# EAGLE design superteensy (EAGLE 7.1.0)
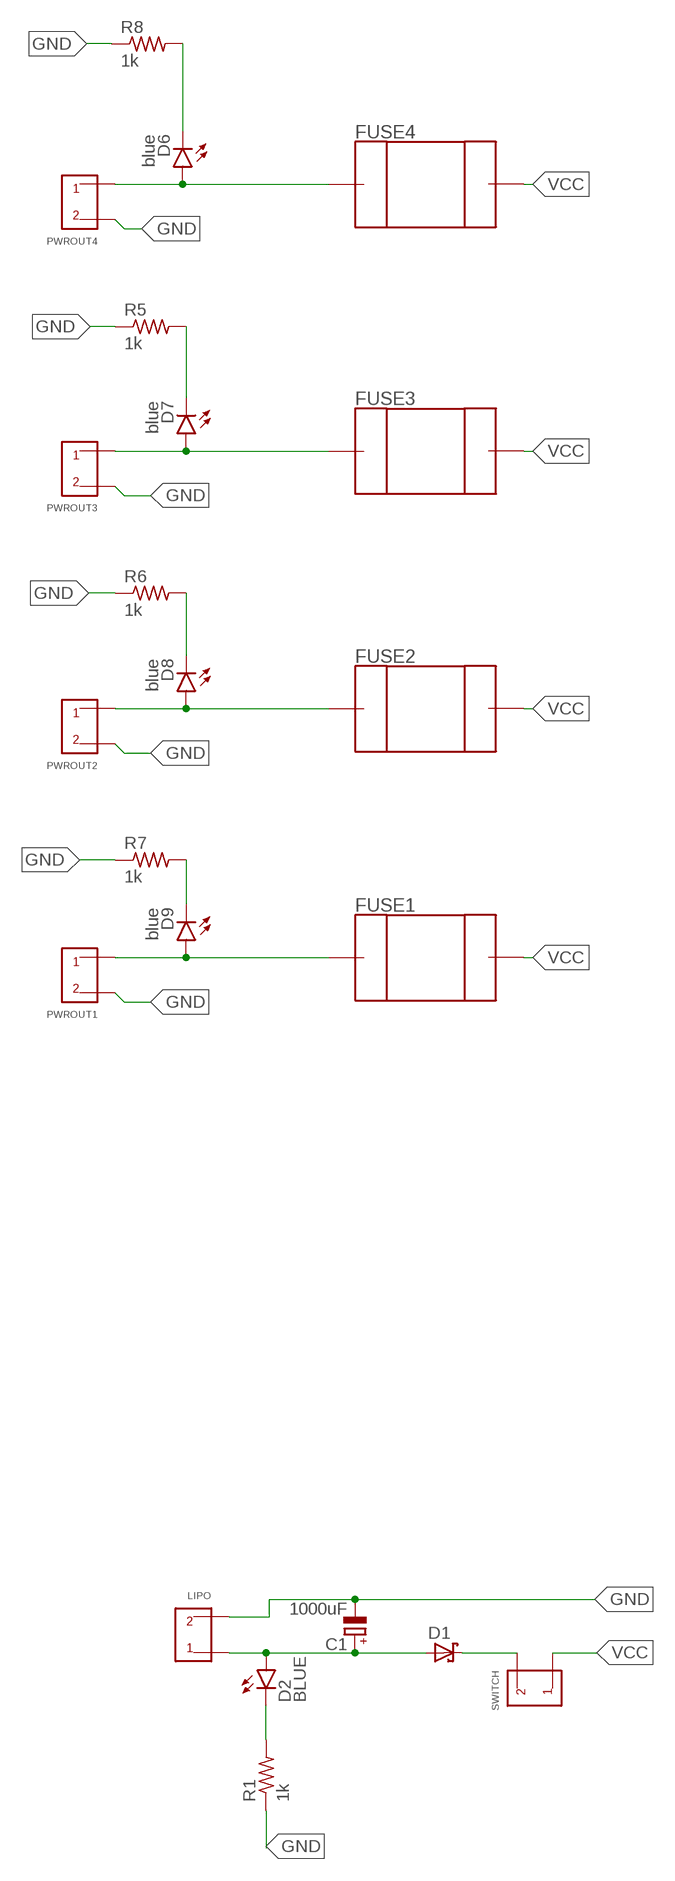
[diagram p0: schematic, sheet 1, part 1 of 2]
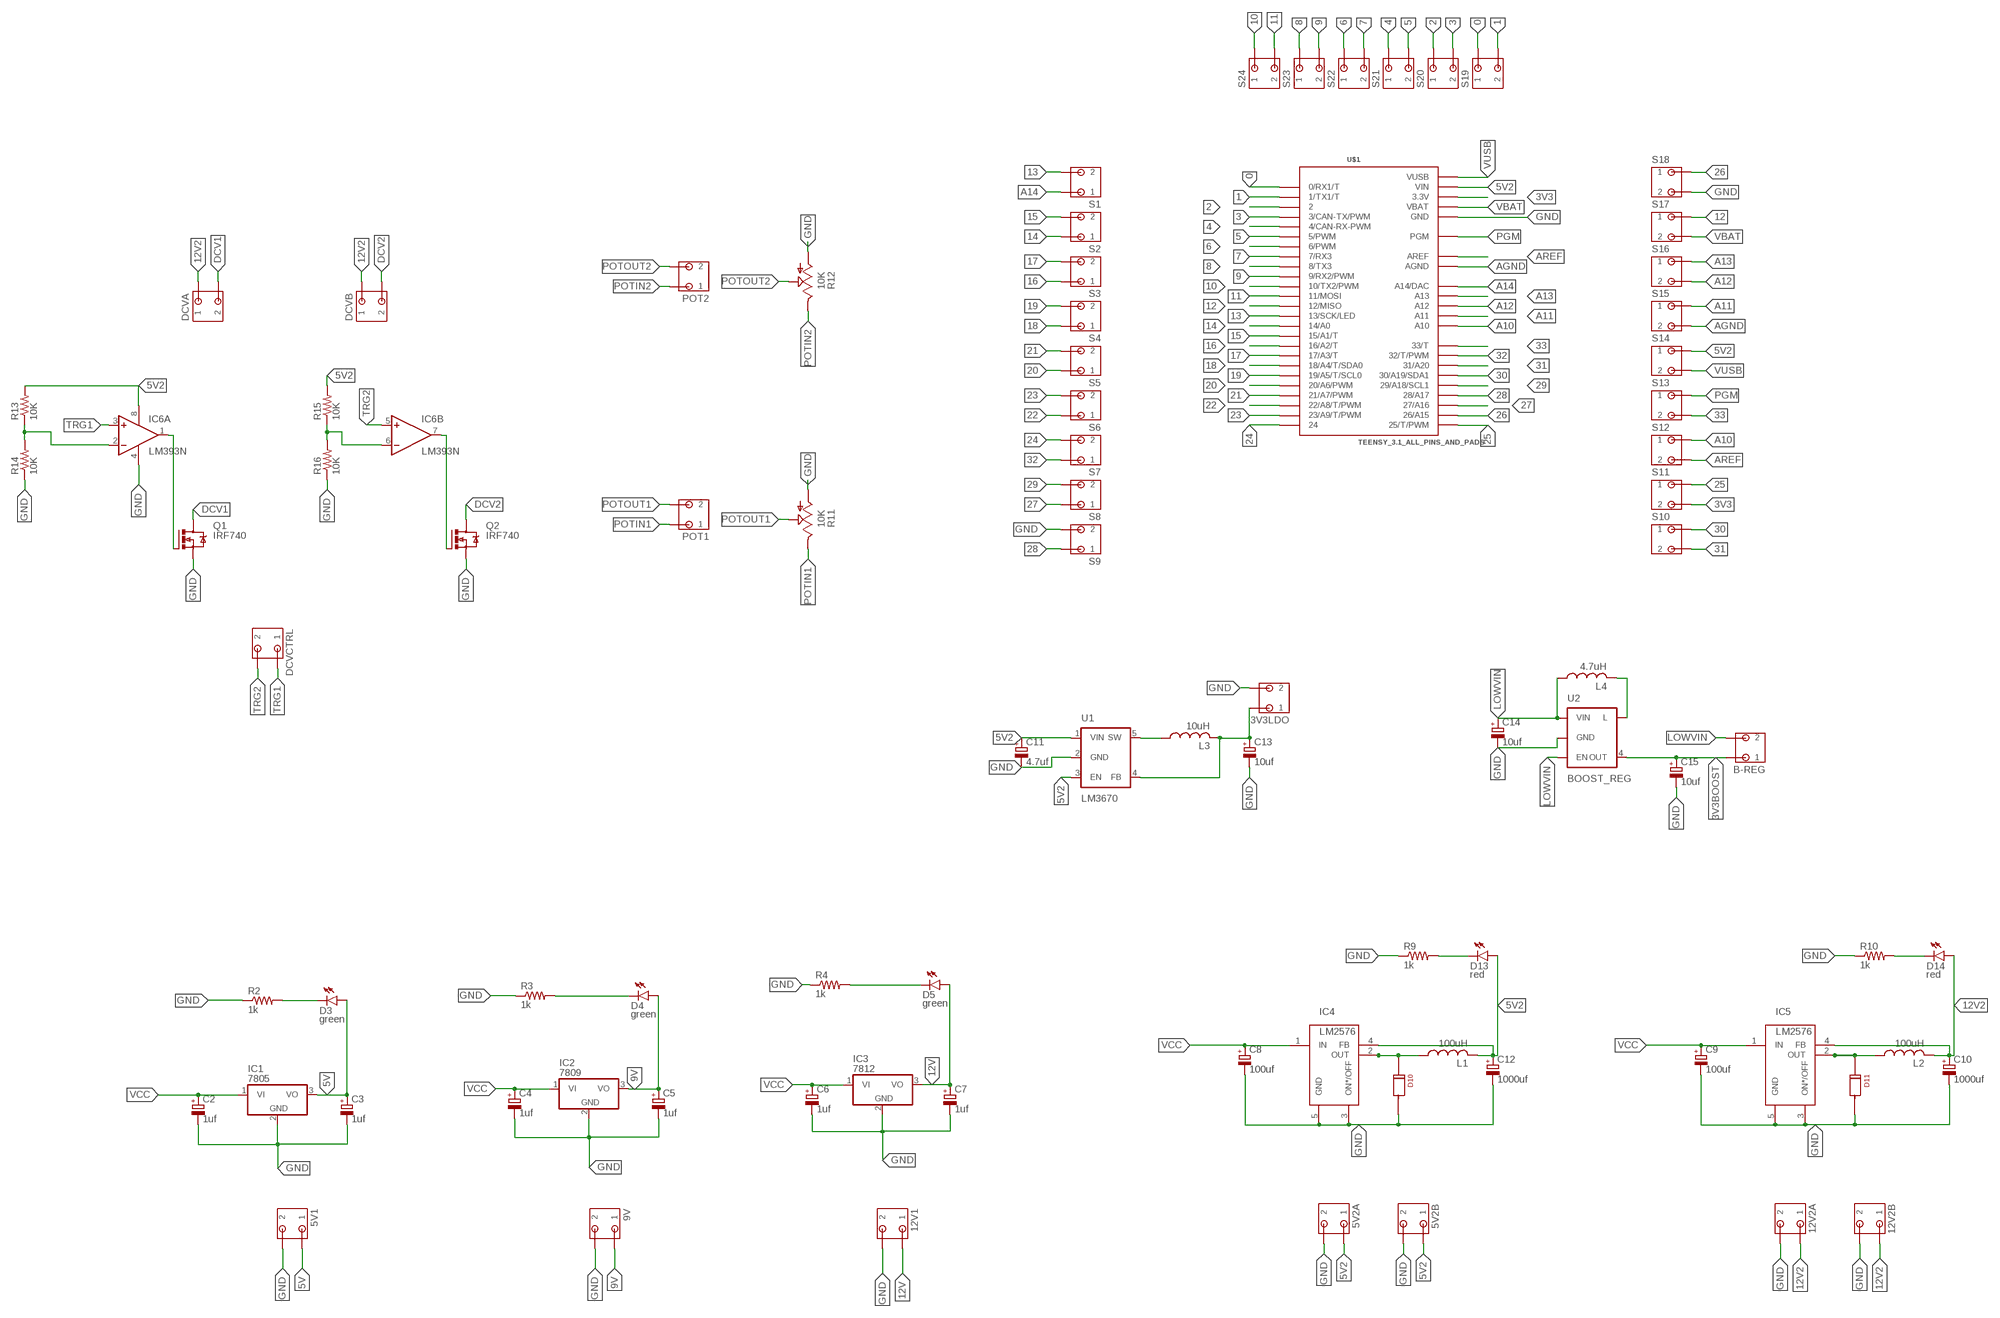
[diagram p1: schematic, sheet 1, part 2 of 2]

## Parts
3V3LDO  SPTBA2-B2  [SPTB]
5V1  SPTBA2-B2  [SPTB]
5V2A  SPTBA2-B2  [SPTB]
5V2B  SPTBA2-B2  [SPTB]
9V  SPTBA2-B2  [SPTB]
12V1  SPTBA2-B2  [SPTB]
12V2A  SPTBA2-B2  [SPTB]
12V2B  SPTBA2-B2  [SPTB]
B-REG  SPTBA2-B2  [SPTB]
C1  1000uF  CPOL-EUE7.5-16  [E7,5-16]
C2  1uf  CPOL-EUE2-5  [E2-5]
C3  1uf  CPOL-EUE2-5  [E2-5]
C4  1uf  CPOL-EUE2-5  [E2-5]
C5  1uf  CPOL-EUE2-5  [E2-5]
C6  1uf  CPOL-EUE2-5  [E2-5]
C7  1uf  CPOL-EUE2-5  [E2-5]
C8  100uf  CPOL-EUE2,5-6E  [E2,5-6E]
C9  100uf  CPOL-EUE2,5-6E  [E2,5-6E]
C10  1000uf  CPOL-EUE7.5-16  [E7,5-16]
C11  4.7uf  CPOL-EUE2-5  [E2-5]
C12  1000uf  CPOL-EUE7.5-16  [E7,5-16]
C13  10uf  CPOL-EUE2-5  [E2-5]
C14  10uf  CPOL-EUE2-5  [E2-5]
C15  10uf  CPOL-EUE2-5  [E2-5]
D1  SCHOTTKY-DIODEP6T15  [P6T15]
D2  BLUE  LED5MM  [LED5MM]
D3  green  LED5MM  [LED5MM]
D4  green  LED5MM  [LED5MM]
D5  green  LED5MM  [LED5MM]
D6  blue  LED5MM  [LED5MM]
D7  blue  LED5MM  [LED5MM]
D8  blue  LED5MM  [LED5MM]
D9  blue  LED5MM  [LED5MM]
D10  1N5822  [1N5822]
D11  1N5822  [1N5822]
D13  red  LED5MM  [LED5MM]
D14  red  LED5MM  [LED5MM]
DCVA  SPTBA2-B2  [SPTB]
DCVB  SPTBA2-B2  [SPTB]
DCVCTRL  SPTBA2-B2  [SPTB]
FUSE1  CPT-FUSE  [CPT-FUSES]
FUSE2  CPT-FUSE  [CPT-FUSES]
FUSE3  CPT-FUSE  [CPT-FUSES]
FUSE4  CPT-FUSE  [CPT-FUSES]
IC1  7805  [78XX]
IC2  7809  [78XX]
IC3  7812  [78XX]
IC4  LM2576  [LM2576]
IC5  LM2576  [LM2576]
IC6  LM393N  [DIL08]
L1  100uH  L-US0204/7  [0204/7]
L2  100uH  L-US0204/7  [0204/7]
L3  10uH  L-US0204/7  [0204/7]
L4  4.7uH  L-US0204/7  [0204/7]
LIPO  SCREW_XT-60  [SCREW_XT-60]
POT1  SPTBA2-B2  [SPTB]
POT2  SPTBA2-B2  [SPTB]
PWROUT1  SCREW_XT-60  [SCREW_XT-60]
PWROUT2  SCREW_XT-60  [SCREW_XT-60]
PWROUT3  SCREW_XT-60  [SCREW_XT-60]
PWROUT4  SCREW_XT-60  [SCREW_XT-60]
Q1  IRF740  [TO220BV]
Q2  IRF740  [TO220BV]
R1  1k  R-US_0204/7  [0204/7]
R2  1k  R-US_0204/7  [0204/7]
R3  1k  R-US_0204/7  [0204/7]
R4  1k  R-US_0204/7  [0204/7]
R5  1k  R-US_0204/7  [0204/7]
R6  1k  R-US_0204/7  [0204/7]
R7  1k  R-US_0204/7  [0204/7]
R8  1k  R-US_0204/7  [0204/7]
R9  1k  R-US_0204/7  [0204/7]
R10  1k  R-US_0204/7  [0204/7]
R11  10K  TRIM_US-CA6V  [CA6V]
R12  10K  TRIM_US-CA6V  [CA6V]
R13  10K  R-US_0204/7  [0204/7]
R14  10K  R-US_0204/7  [0204/7]
R15  10K  R-US_0204/7  [0204/7]
R16  10K  R-US_0204/7  [0204/7]
S1  SPTBA2-B2  [SPTB]
S2  SPTBA2-B2  [SPTB]
S3  SPTBA2-B2  [SPTB]
S4  SPTBA2-B2  [SPTB]
S5  SPTBA2-B2  [SPTB]
S6  SPTBA2-B2  [SPTB]
S7  SPTBA2-B2  [SPTB]
S8  SPTBA2-B2  [SPTB]
S9  SPTBA2-B2  [SPTB]
S10  SPTBA2-B2  [SPTB]
S11  SPTBA2-B2  [SPTB]
S12  SPTBA2-B2  [SPTB]
S13  SPTBA2-B2  [SPTB]
S14  SPTBA2-B2  [SPTB]
S15  SPTBA2-B2  [SPTB]
S16  SPTBA2-B2  [SPTB]
S17  SPTBA2-B2  [SPTB]
S18  SPTBA2-B2  [SPTB]
S19  SPTBA2-B2  [SPTB]
S20  SPTBA2-B2  [SPTB]
S21  SPTBA2-B2  [SPTB]
S22  SPTBA2-B2  [SPTB]
S23  SPTBA2-B2  [SPTB]
S24  SPTBA2-B2  [SPTB]
SWITCH  SCREW_XT-60  [SCREW_XT-60]
U1  LM3670  V_REG_LDOSMD  [SOT23-5]
U2  BOOST_REG  V_REG_LDOSMD  [SOT23-5]
U$1  TEENSY_3.1_ALL_PINS_AND_PADS  [TEENSY_3.1_ALLPINS]

## Nets
0: S19.A1 S19.A2 U$1.0(0/RX1/T)
1: S19.B1 S19.B2 U$1.1(1/TX1/T)
2: S20.A1 S20.A2 U$1.2
3: S20.B1 S20.B2 U$1.3(3/CAN-TX/PWM)
3V3: S11.B1 S11.B2 U$1.3.3V U$1.3.3V1(3.3V) U$1.3.3V2(3.3V)
3V3BOOST: B-REG.A1 B-REG.A2 C15.+ U2.4(OUT)
4: S21.A1 S21.A2 U$1.4(4/CAN-RX-PWM)
5: S21.B1 S21.B2 U$1.5(5/PWM)
5V: 5V1.A1 5V1.A2 C3.+ D3.A IC1.3(VO)
5V2: 5V2A.A1 5V2A.A2 5V2B.A1 5V2B.A2 C11.+ C12.+ D13.A IC4.4(FB) IC6.8(P:V+) L1.2 R13.2 R15.2 S14.A1 S14.A2 U1.1(VIN) U1.3(EN) U$1.VIN
6: S22.A1 S22.A2 U$1.6(6/PWM)
7: S22.B1 S22.B2 U$1.7(7/RX3)
8: S23.A1 S23.A2 U$1.8(8/TX3)
9: S23.B1 S23.B2 U$1.9(9/RX2/PWM)
9V: 9V.A1 9V.A2 C5.+ D4.A IC2.3(VO)
10: S24.A1 S24.A2 U$1.10(10/TX2/PWM)
11: S24.B1 S24.B2 U$1.11(11/MOSI)
12: S17.A1 S17.A2 U$1.12(12/MISO)
12V: 12V1.A1 12V1.A2 C7.+ D5.A IC3.3(VO)
12V2: 12V2A.A1 12V2A.A2 12V2B.A1 12V2B.A2 C10.+ D14.A DCVA.A1 DCVA.A2 DCVB.A1 DCVB.A2 IC5.4(FB) L2.2
13: S1.B1 S1.B2 U$1.13(13/SCK/LED)
14: S2.A1 S2.A2 U$1.14/A0
15: S2.B1 S2.B2 U$1.15/A1(15/A1/T)
16: S3.A1 S3.A2 U$1.16/A2(16/A2/T)
17: S3.B1 S3.B2 U$1.17/A3(17/A3/T)
18: S4.A1 S4.A2 U$1.18/A4(18/A4/T/SDA0)
19: S4.B1 S4.B2 U$1.19/A5(19/A5/T/SCL0)
20: S5.A1 S5.A2 U$1.20/A6(20/A6/PWM)
21: S5.B1 S5.B2 U$1.21/A7(21/A7/PWM)
22: S6.A1 S6.A2 U$1.22/A8(22/A8/T/PWM)
23: S6.B1 S6.B2 U$1.23/A9(23/A9/T/PWM)
24: S7.B1 S7.B2 U$1.24
25: S11.A1 S11.A2 U$1.25(25/T/PWM)
26: S18.A1 S18.A2 U$1.26(26/A15)
27: S8.A1 S8.A2 U$1.27(27/A16)
28: S9.A1 S9.A2 U$1.28(28/A17)
29: S8.B1 S8.B2 U$1.29(29/A18/SCL1)
30: S10.A1 S10.A2 U$1.30(30/A19/SDA1)
31: S10.B1 S10.B2 U$1.31(31/A20)
32: S7.A1 S7.A2 U$1.32(32/T/PWM)
33: S13.B1 S13.B2 U$1.33(33/T)
A10: S12.A1 S12.A2 U$1.A10
A11: S15.A1 S15.A2 U$1.A11
A12: S16.B1 S16.B2 U$1.A12
A13: S16.A1 S16.A2 U$1.A13
A14: S1.A1 S1.A2 U$1.A14(A14/DAC)
AGND: S15.B1 S15.B2 U$1.AGND
AREF: S12.B1 S12.B2 U$1.AREF
DCV1: DCVA.B1 DCVA.B2 Q1.D
DCV2: DCVB.B1 DCVB.B2 Q2.D
GND: 3V3LDO.B1 3V3LDO.B2 5V1.B1 5V1.B2 5V2A.B1 5V2A.B2 5V2B.B1 5V2B.B2 9V.B1 9V.B2 12V1.B1 12V1.B2 12V2A.B1 12V2A.B2 12V2B.B1 12V2B.B2 C1.- C2.- C3.- C4.- C5.- C6.- C7.- C8.- C9.- C10.- C11.- C12.- C13.- C14.- C15.- D10.- D11.- IC1.2(GND) IC2.2(GND) IC3.2(GND) IC4.3(ON*/OFF) IC4.5(GND) IC5.3(ON*/OFF) IC5.5(GND) IC6.4(P:V-) LIPO.P$2 PWROUT1.P$2 PWROUT2.P$2 PWROUT3.P$2 PWROUT4.P$2 Q1.S Q2.S R1.1 R2.1 R3.1 R4.1 R5.1 R6.1 R7.1 R8.1 R9.1 R10.1 R11.A R12.A R14.1 R16.1 S9.B1 S9.B2 S18.B1 S18.B2 U1.2(GND) U2.2(GND) U$1.GND U$1.GND1(GND) U$1.GND2(GND)
LOWVIN: B-REG.B1 B-REG.B2 C14.+ L4.1 U2.1(VIN) U2.3(EN)
N$1: C1.+ D1.A D2.A LIPO.P$1
N$2: D1.C SWITCH.P$2
N$3: D3.K(C) R2.2
N$4: D2.K(C) R1.2
N$5: D4.K(C) R3.2
N$6: D5.K(C) R4.2
N$7: D6.A FUSE4.P$1 PWROUT4.P$1
N$8: D7.A FUSE3.P$1 PWROUT3.P$1
N$9: D8.A FUSE2.P$1 PWROUT2.P$1
N$10: D9.A FUSE1.P$1 PWROUT1.P$1
N$11: D9.K(C) R7.2
N$12: D8.K(C) R6.2
N$13: D7.K(C) R5.2
N$14: D6.K(C) R8.2
N$15: D13.K(C) R9.2
N$16: D10.+ IC4.2(OUT) L1.1
N$17: D11.+ IC5.2(OUT) L2.1
N$18: D14.K(C) R10.2
N$19: IC6.1(A:OUT) Q1.G
N$20: IC6.7(B:OUT) Q2.G
N$21: IC6.2(A:-IN) R13.1 R14.2
N$22: IC6.6(B:-IN) R15.1 R16.2
N$25: L3.1 U1.5(SW)
N$26: 3V3LDO.A1 3V3LDO.A2 C13.+ L3.2 U1.4(FB)
N$28: L4.2 U2.5(L)
PGM: S13.A1 S13.A2 U$1.PGM
POTIN1: POT1.A1 POT1.A2 R11.E
POTIN2: POT2.A1 POT2.A2 R12.E
POTOUT1: POT1.B1 POT1.B2 R11.S
POTOUT2: POT2.B1 POT2.B2 R12.S
TRG1: DCVCTRL.A1 DCVCTRL.A2 IC6.3(A:+IN)
TRG2: DCVCTRL.B1 DCVCTRL.B2 IC6.5(B:+IN)
VBAT: S17.B1 S17.B2 U$1.VBAT
VCC: C2.+ C4.+ C6.+ C8.+ C9.+ FUSE1.P$2 FUSE2.P$2 FUSE3.P$2 FUSE4.P$2 IC1.1(VI) IC2.1(VI) IC3.1(VI) IC4.1(IN) IC5.1(IN) SWITCH.P$1
VUSB: S14.B1 S14.B2 U$1.VUSB

## Library data of the parts
3V3LDO 5V1 5V2A 5V2B 9V 12V1 12V2A 12V2B B-REG DCVA DCVB POT1 POT2 S1-S24 = #rcn-15:SPTB
C1-C15 = rcl:CPOL-EU: POLARIZED CAPACITOR, European symbol
D1 = diode:SCHOTTKY-DIODE: Schottky Diode
D2-D9 D13 D14 = SparkFun-LED:LED: LEDs Standard schematic elements and footprints for 5mm, 3mm, 1206, and 0603 sized LEDs. 5mm - Spark Fun Electronics SKU : COM-00529 (and others)
D10 D11 = #rcn-15:1N5822
DCVCTRL = #rcn-15-new-A2-b2-appended:SPTB
FUSE1-FUSE4 = #rcn-15:CPT-FUSE
IC1-IC3 = #rcn-15:78*: Positive VOLTAGE REGULATOR Source: http://cache.national.com/ds/LM/LM78L05.pdf http://www.fairchildsemi.com/ds/LM/LM7805.pdf
IC4 IC5 = LM2576:LM2576: LM2576 - 5V switching regulator
IC6 = linear:LM393: COMPARATOR
L1-L4 = rcl:L-US: INDUCTOR, American symbol
LIPO PWROUT1-PWROUT4 SWITCH = #rcn-15:SCREW_XT-60
Q1 Q2 = transistor-power:IRF740: N-CHANNEL MOS FET
R1-R10 R13-R16 = rcl:R-US_: RESISTOR, American symbol
R11 R12 = pot:TRIM_US-: POTENTIOMETER
U1 = lm3670-ldo:V_REG_LDO: Voltage Regulator LDO Standard 150mA LDO voltage regulator in SOT-23 layout. Micrel part MIC5205. BP (by-pass) pin is used to lower output noise with 470pF cap.
U2 = synchronous-boot-regulator-TPS61097A-33:V_REG_LDO: Voltage Regulator LDO Standard 150mA LDO voltage regulator in SOT-23 layout. Micrel part MIC5205. BP (by-pass) pin is used to lower output noise with 470pF cap.
U$1 = Teensy_3_Series_Board_v1.0:TEENSY_3.1_ALL_PINS_AND_PADS: Footprint for Teensy 3.1 board using all pads and all through-holes. Pads need a 2x7 0.1" SMD header.

## Board
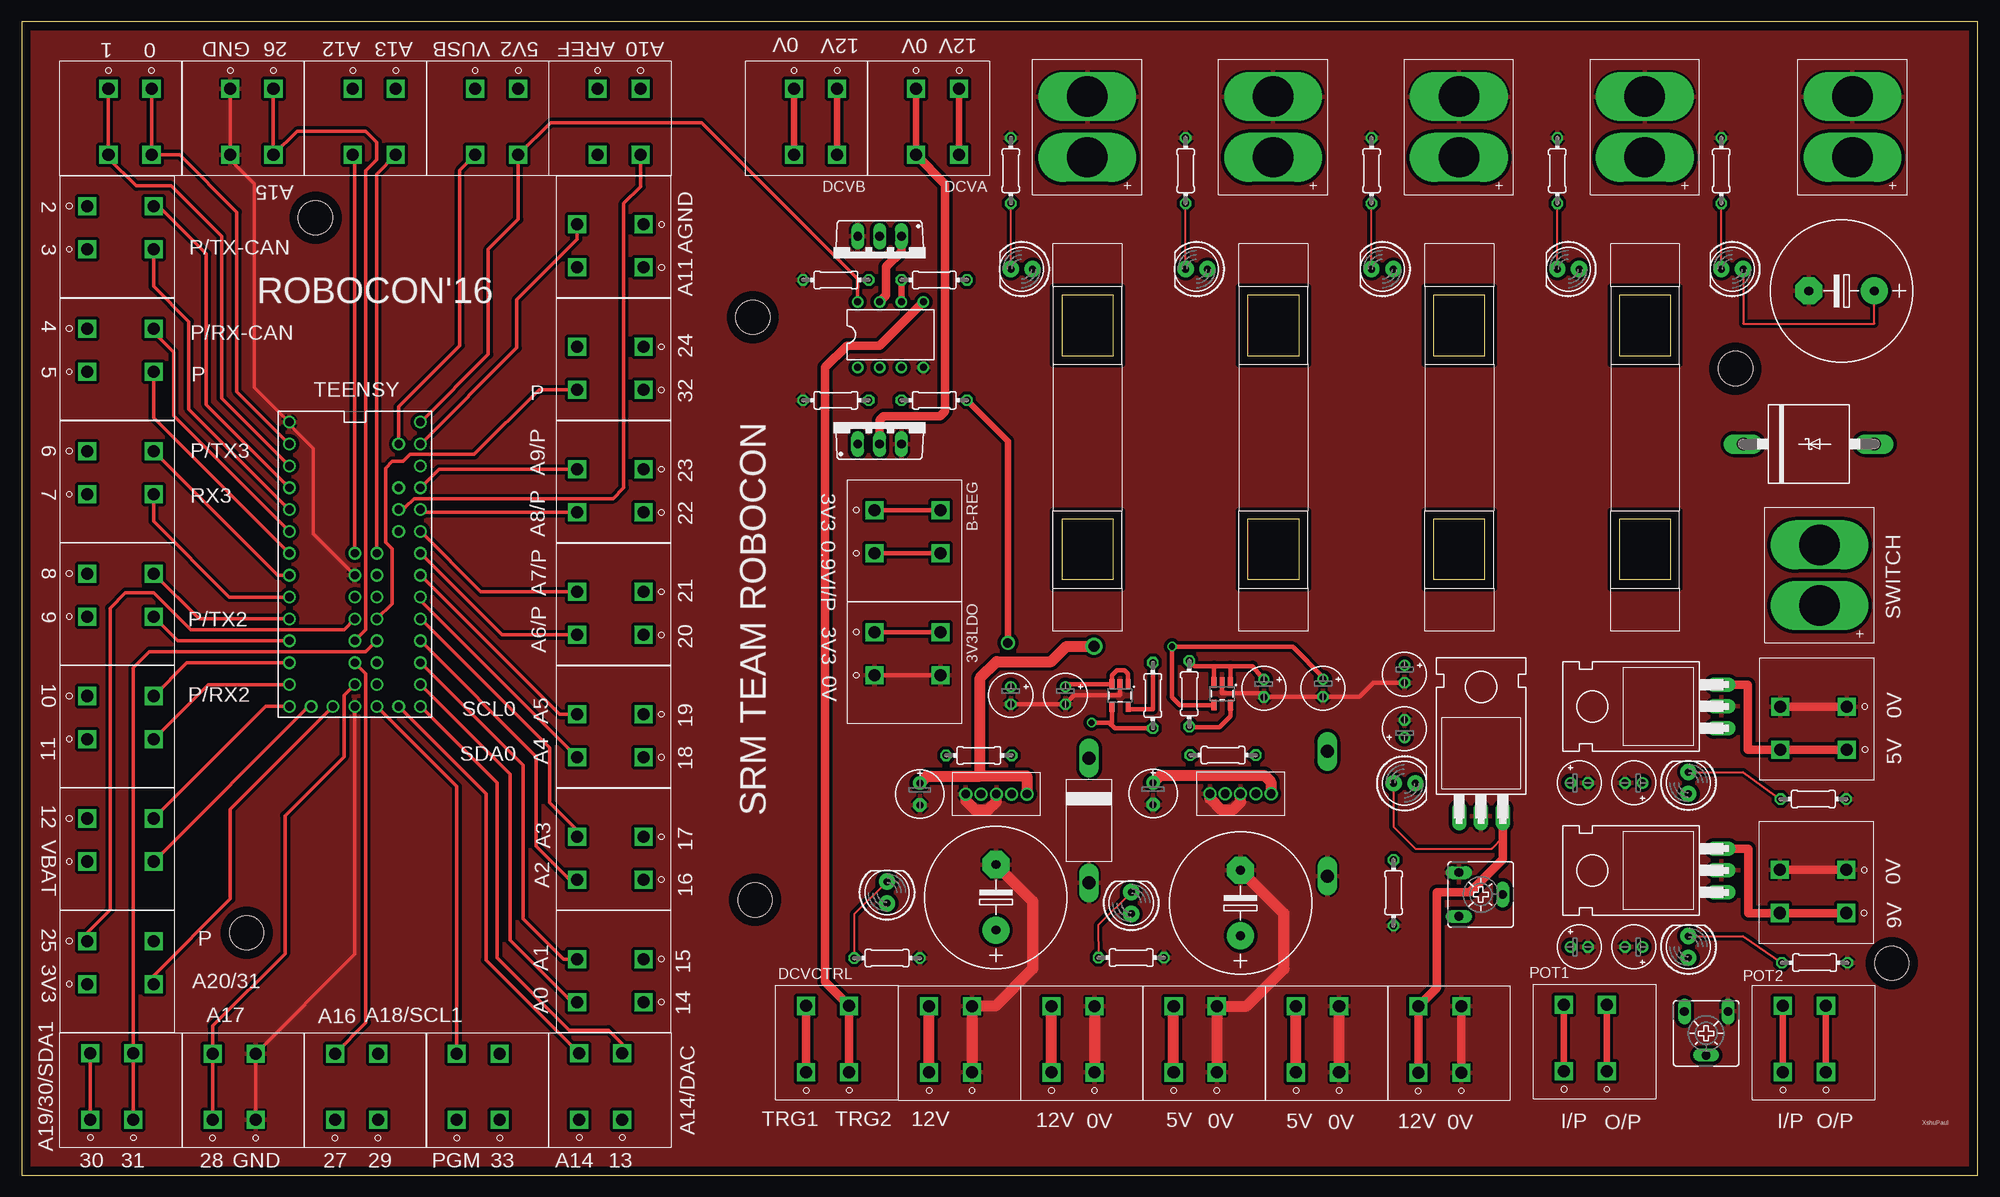
[diagram p2: board, top side]
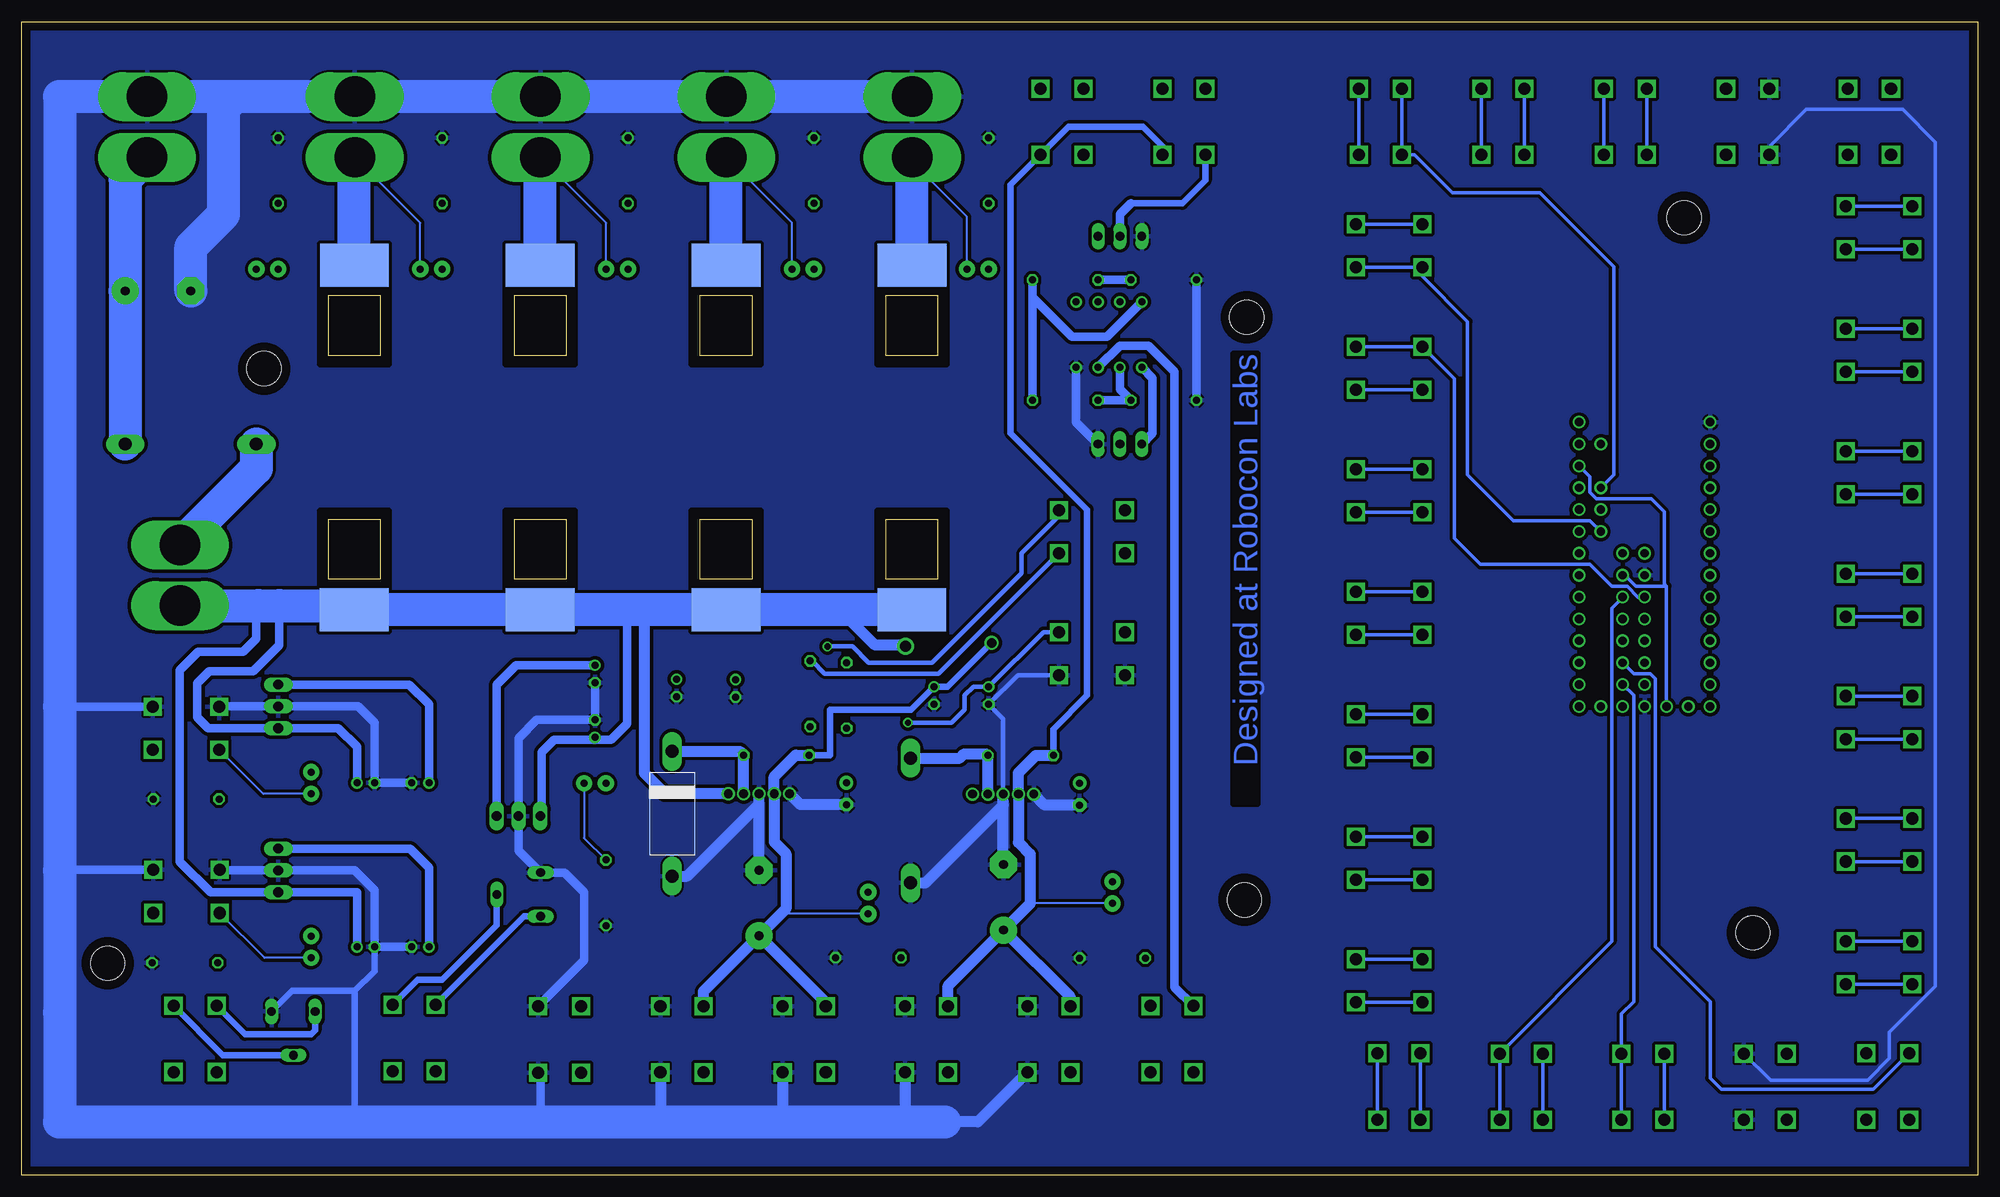
[diagram p3: board, bottom side, seen from below]

Size 227.31 x 134.04 mm. Coordinates in mm from the lower left corner, seen from the top.
Outline: 0,0 227.31,0 227.31,134.04 0,134.04 0,0
Copper layers (1*16): Top 0.035mm / dielectric 1.5mm / Bottom 0.035mm
Design rules "default *": minimum track width 10mil, minimum drill 24mil, track to track 10mil, track to pad 10mil, pad to pad 10mil, via to via 10mil, smd to smd 10mil, copper to edge 40mil, drill to drill 8mil, minimum pad ring 10mil, minimum via ring 8mil, stop-mask expansion 4mil, vias tented up to drill 0mil, thermal gap 10mil
Holes 4 mm at 85.22,32 84.96,99.7 217.3,24.64 199.14,93.73 34.16,111.25 26.16,28.19

### Footprints (pad centres in the part's own frame; a part is rotated, then mirrored left to right if it is on the bottom)
SPTB = drill 1.4 square: A1 -2.28,-3.15; A2 -2.28,4.55; B1 2.72,-3.15; B2 2.72,4.55
E7,5-16 = drill 1.016 pad 3.15: + -3.81,0 | drill 1.016 pad 3.15 octagon: - 3.81,0
E2-5 = drill 0.813 pad 1.27: + -1.016,0 | drill 0.813 pad 1.27 octagon: - 1.016,0
E2,5-6E = drill 0.813 pad 1.575: + -1.27,0 | drill 0.813 pad 1.575 octagon: - 1.27,0
P6T15 = drill 1.499 long: A 7.62,0; C -7.62,0
LED5MM = drill 0.813 pad 1.88: A -1.27,0; K 1.27,0
1N5822 = drill 1.5 long: + -7,0; - 7.5,0
CPT-FUSES = smd 5 x 8 bottom: P$1 -19.492,0.039; P$2 20.502,0.055
78XX = drill 1.118 long: 1 -2.54,-8.89; 2 0,-8.89; 3 2.54,-8.89
LM2576 = drill 1.016: 1 -3.556,0; 2 -1.778,0; 3 0,0; 4 1.778,0; 5 3.556,0
DIL08 = drill 0.813 pad 1.27: 1 -3.81,-3.81; 2 -1.27,-3.81; 3 1.27,-3.81; 4 3.81,-3.81; 5 3.81,3.81; 6 1.27,3.81; 7 -1.27,3.81; 8 -3.81,3.81
0204/7 = drill 0.813 octagon: 1 -3.81,0; 2 3.81,0
SCREW_XT-60 = drill 4.699 long: P$1 -3.524,0; P$2 3.524,0
TO220BV = drill 1.016 long: D 0,-2.54; G -2.54,-2.54; S 2.54,-2.54
CA6V = drill 1.016 long: A -2.54,-2.54; E 2.54,-2.54; S 0,2.54
SOT23-5 = smd 0.55 x 1.2: 1 -0.95,-1.3; 2 0,-1.3; 3 0.95,-1.3; 4 0.95,1.3; 5 -0.95,1.3
TEENSY_3.1_ALLPINS = drill 0.965: 0 -7.62,15.24; 1 -7.62,12.7; 2 -7.62,10.16; 3 -7.62,7.62; 3.3V 7.62,12.7; 3.3V1 -2.54,-15.24; 3.3V2 2.54,0; 4 -7.62,5.08; 5 -7.62,2.54; 6 -7.62,0; 7 -7.62,-2.54; 8 -7.62,-5.08; 9 -7.62,-7.62; 10 -7.62,-10.16; 11 -7.62,-12.7; 12 -7.62,-15.24; 13 7.62,-15.24; 14/A0 7.62,-12.7; 15/A1 7.62,-10.16; 16/A2 7.62,-7.62; 17/A3 7.62,-5.08; 18/A4 7.62,-2.54; 19/A5 7.62,0; 20/A6 7.62,2.54; 21/A7 7.62,5.08; 22/A8 7.62,7.62; 23/A9 7.62,10.16; 24 0,-2.54; 25 0,-5.08; 26 0,-7.62; 27 0,-10.16; 28 0,-12.7; 29 2.54,-12.7; 30 2.54,-10.16; 31 2.54,-7.62; 32 2.54,-5.08; 33 2.54,-2.54; A10 5.08,7.62; A11 5.08,5.08; A12 0,2.54; A13 2.54,2.54; A14 5.08,-15.24; AGND 7.62,15.24; AREF 5.08,10.16; GND -7.62,17.78; GND1 0,-15.24; GND2 0,0; PGM 2.54,-15.24; VBAT -5.08,-15.24; VIN 7.62,17.78; VUSB 5.08,15.24

### Placement (x,y rotation side)
3V3LDO  102.24,60.83 270 top
5V1  208.91,51.74 90 top
5V2A  136.14,15.11 0 top
5V2B  150.37,15.11 0 top
9V  208.84,32.77 90 top
12V1  164.57,15.09 0 top
12V2A  121.95,15.11 0 top
12V2B  107.72,15.11 0 top
B-REG  102.24,75.01 270 top
C1  211.46,102.74 180 top
C2  187.33,45.59 180 top
C3  180.97,45.59 0 top
C4  187.33,26.54 180 top
C5  180.97,26.54 0 top
C6  160.68,51.89 90 top
C7  160.68,58.24 270 top
C8  131.47,44.35 270 top
C9  104.37,44.3 270 top
C10  113.21,32.31 90 top
C11  121.28,55.75 270 top
C12  141.63,31.65 90 top
C13  114.94,55.75 270 top
C14  144.35,56.59 270 top
C15  151.21,56.62 270 top
D1  207.65,84.96 0 top
D2  198.76,105.28 180 top
D3  193.67,45.59 90 top
D4  193.67,26.54 90 top
D5  160.68,45.54 0 top
D6  116.21,105.28 180 top
D7  136.53,105.28 180 top
D8  158.11,105.28 180 top
D9  179.71,105.28 180 top
D10  151.71,42.27 270 bottom
D11  124.03,41.48 270 top
D13  128.93,31.65 90 top
D14  100.56,32.87 90 top
DCVA  106.65,123.09 180 top
DCVB  92.48,123.09 180 top
DCVCTRL  93.45,15.14 0 top
FUSE1  188.59,86.23 270 top
FUSE2  167.01,86.23 270 top
FUSE3  145.41,86.23 270 top
FUSE4  123.82,86.23 270 top
IC1  188.59,54.48 90 top
IC2  188.59,35.43 90 top
IC3  169.57,50.62 0 top
IC4  141.63,44.35 180 top
IC5  113.26,44.3 180 top
IC6  100.97,97.66 0 top
L1  139.6,48.82 180 top
L2  111.23,48.79 180 top
L3  131.44,55.75 270 top
L4  135.69,55.96 270 top
LIPO  212.72,121.79 90 top
POT1  181.48,15.27 0 top
POT2  206.93,15.16 0 top
PWROUT1  188.59,121.79 90 top
PWROUT2  167.01,121.79 90 top
PWROUT3  145.41,121.79 90 top
PWROUT4  123.82,121.79 90 top
Q1  99.69,87.5 0 top
Q2  99.69,106.55 180 top
R1  197.48,116.71 270 top
R2  208.18,43.71 180 top
R3  208.33,24.71 180 top
R4  159.41,32.84 90 top
R5  135.25,116.71 270 top
R6  156.84,116.71 270 top
R7  178.43,116.71 270 top
R8  114.94,116.71 270 top
R9  128.93,25.3 180 top
R10  100.56,25.25 180 top
R11  169.54,32.64 270 top
R12  195.73,16.51 180 top
R13  106.05,90.04 0 top
R14  94.62,90.04 0 top
R15  106.05,104.01 0 top
R16  94.62,104.01 0 top
S1  67.08,9.65 0 top
S2  69.1,22.41 90 top
S3  69.1,36.63 90 top
S4  69.1,50.86 90 top
S5  69.1,65.08 90 top
S6  69.1,79.31 90 top
S7  69.1,93.53 90 top
S8  38.7,9.61 0 top
S9  24.47,9.61 0 top
S10  10.27,9.64 0 top
S11  10.8,24.95 270 top
S12  69.65,123.09 180 top
S13  52.84,9.61 0 top
S14  55.44,123.09 180 top
S15  69.11,107.75 90 top
S16  41.21,123.09 180 top
S17  10.8,39.19 270 top
S18  26.99,123.09 180 top
S19  12.82,123.09 180 top
S20  10.8,110.31 270 top
S21  10.8,96.08 270 top
S22  10.8,81.86 270 top
S23  10.8,67.63 270 top
S24  10.8,53.41 270 top
SWITCH  208.91,69.72 90 top
U1  127.63,55.75 180 top
U2  139.5,55.96 180 top
U$1  38.74,69.72 0 top

### Tracks (layer width: path | path; a pad name or v marks a point on that pad's centre or on a via)
0
  Top 0.381: U$1.0 25.02,91.06 25.02,111.89 18.37,118.54 S19.A2 S19.A1
1
  Top 0.381: U$1.1 23.24,90.3 23.24,109.09 17.4,114.94 13.33,114.94 10.1,118.17 S19.B2 S19.B1
2
  Top 0.381: U$1.2 21.46,89.54 21.46,107.06 15.94,112.59 S20.A2
  Bottom 0.381: S20.A2 S20.A1
3
  Top 0.381: U$1.3 19.43,89.03 19.43,99.19 15.34,103.27 S20.B2
  Bottom 0.381: S20.B2 S20.B1
3V3
  Top 0.381: U$1.3.3V1 24.26,42.55 24.26,32.13 15.34,23.22 S11.B2
  Bottom 0.381: U$1.3.3V 45.08,81.15 45.08,79.38 44.32,78.61 37.97,78.61 36.45,77.09 36.45,68.71 | 36.45,68.71 36.45,68.45 39.75,68.45 41.02,69.72 U$1.3.3V2 | U$1.3.3V1 36.19,68.45 36.45,68.71 | S11.B2 S11.B1
3V3BOOST  (via drill 0.7)
  Top 0.508: B-REG.A2 B-REG.A1 | C15.+ 151.21,57.89 147.7,61.39 133.73,61.39 v133.68,61.44 133.65,61.44 133.65,55.58 134.62,54.61 138.5,54.61 U2.4
  Bottom 0.508: 106.78,77.34 B-REG.A2 106.78,76.6 111.12,72.26 111.12,69.98 121.54,59.56 128.9,59.56 130.78,61.44 v133.68,61.44
4
  Top 0.381: U$1.4 17.65,88.27 17.65,95.63 15.34,97.94 S21.A2
  Bottom 0.381: S21.A2 S21.A1
5
  Top 0.381: U$1.5 15.34,88.03 S21.B2
  Bottom 0.381: S21.B2 S21.B1
5V
  Top 1.016: IC1.3 200.56,57.02 200.56,49.45 5V1.A2 5V1.A1
  Bottom 0.254: D3.A 199.23,44.32 5V1.A2
  Bottom 1.016: C3.+ 179.96,54.74 182.24,57.02 IC1.3
5V2  (via drill 1.1)
  Top 0.381: U$1.VIN 54.23,95.38 54.23,107.57 57.72,111.06 S14.A2 61.48,122.3 78.99,122.3 97.15,104.14 IC6.8
  Top 0.508: C11.+ 121.57,57.05 U1.3 126.68,58.11 127.25,58.67 128.17,58.67 128.57,58.27 128.57,57.06 U1.1
  Top 0.762: v114.6,61.87 114.6,85.29 R13.2
  Top 1.27: 5V2B.A1 5V2B.A2 | 5V2A.A1 5V2A.A2
  Bottom 0.254: D13.A 139.09,30.38
  Bottom 0.381: S14.A1 S14.A2
  Bottom 0.762: L1.2 133.38,48.82 133.35,54.1 123.95,54.1 C11.+ 119.71,56.77 v114.6,61.87
  Bottom 1.016: R13.2 R15.2 109.85,101.98 105.28,97.41 101.22,97.41 IC6.8
  Bottom 1.27: C12.+ 139.09,30.38 138.51,30.96 138.51,37.39 139.85,38.74 IC4.4 139.85,46.33 137.36,48.82 L1.2 | 5V2B.A2 148.09,21.38 C12.+ | 5V2A.A2 133.86,20.07 C12.+
6
  Top 0.381: U$1.6 29.76,69.72 S22.A2
  Bottom 0.381: S22.A2 S22.A1
7
  Top 0.381: U$1.7 24.16,67.18 15.34,76 S22.B2
  Bottom 0.381: S22.B2 S22.B1
8
  Top 0.381: U$1.8 20.62,64.64 S23.A2
  Bottom 0.381: S23.A2 S23.A1
9
  Top 0.381: U$1.9 18.16,62.1 S23.B2
  Bottom 0.381: S23.B2 S23.B1
9V
  Top 1.016: IC2.3 200.61,37.97 200.61,30.48 9V.A2 9V.A1
  Bottom 0.254: D4.A 199.08,25.27 9V.A2
  Bottom 1.016: IC2.3 182.17,37.97 179.96,35.76 C5.+
10
  Top 0.381: U$1.10 19.22,59.56 S24.A2
  Bottom 0.381: S24.A2 S24.A1
11
  Top 0.381: U$1.11 21.68,57.02 S24.B2
  Bottom 0.381: S24.B2 S24.B1
12
  Top 0.381: U$1.12 28.36,54.48 S17.A2
  Bottom 0.381: S17.A2 S17.A1
12V
  Top 0.254: D5.A 159.41,40.49 161.92,37.97 170.81,37.97 172.11,39.27 IC3.3
  Top 1.016: IC3.3 172.11,36.73 168.27,32.89 164.46,32.89 164.46,21.82 12V1.A2 12V1.A1
  Bottom 1.016: C7.+ 169.82,59.26 172.11,56.97 IC3.3
12V2
  Top 0.762: DCVA.A1 DCVA.A2 | DCVB.A1 DCVB.A2
  Top 1.27: 12V2A.A1 12V2A.A2 | 12V2B.A1 12V2B.A2
  Bottom 0.254: D14.A 110.11,31.6 110.6,31.1
  Bottom 0.762: L2.2 107.42,51.84 103.5,55.75 103.5,77.34 112.39,86.23 112.39,115.08 DCVA.A2 105.68,121.79 97.03,121.79 94.76,119.53 DCVB.A2
  Bottom 1.27: C10.+ 110.6,31.1 110.13,31.57 110.13,37.34 111.48,38.68 IC5.4 111.48,46.76 109.45,48.79 L2.2 | 12V2B.A2 105.44,20.73 C10.+ | 12V2A.A2 119.67,22.04 C10.+
13
  Top 0.381: U$1.13 55.24,45.59 55.24,25.27 63.63,16.89 68.2,16.89 69.79,15.3 S1.B2
  Bottom 0.381: S1.B2 S1.B1
14
  Top 0.381: U$1.14/A0 56.77,46.61 56.77,27.31 63.94,20.13 S2.A2
  Bottom 0.381: S2.A2 S2.A1
15
  Top 0.381: U$1.15/A1 58.29,47.63 58.29,29.85 63.01,25.13 S2.B2
  Bottom 0.381: S2.B1 S2.B2
16
  Top 0.381: U$1.16/A2 59.82,48.64 59.82,38.23 63.69,34.35 S3.A2
  Bottom 0.381: S3.A1 S3.A2
17
  Top 0.381: U$1.17/A3 61.34,49.66 61.34,43.31 64.55,40.1 S3.B2
  Bottom 0.381: S3.B1 S3.B2
18
  Top 0.381: U$1.18/A4 46.35,66.77 S4.A2
  Bottom 0.381: S4.A1 S4.A2
19
  Top 0.381: U$1.19/A5 62.5,53.58 S4.B2
  Bottom 0.381: S4.B1 S4.B2
20
  Top 0.381: U$1.20/A6 55.82,62.8 S5.A2
  Bottom 0.381: S5.A1 S5.A2
21
  Top 0.381: U$1.21/A7 53.36,67.8 S5.B2
  Bottom 0.381: S5.B1 S5.B2
22
  Top 0.381: U$1.22/A8 46.67,77.03 S6.A2
  Bottom 0.381: S6.A2 S6.A1
23
  Top 0.381: U$1.23/A9 48.5,82.03 S6.B2
  Bottom 0.381: S6.B2 S6.B1
24
  Bottom 0.381: U$1.24 39.5,67.18 40.77,68.45 42.54,68.45 45.08,70.99 57.78,70.99 60.83,74.04 60.83,92.53 S7.B2 S7.B1
25
  Top 0.381: U$1.25 37.46,63.37 19.68,63.37 15.37,67.69 12.06,67.69 10.29,65.91 10.29,30.86 7.64,28.22 S11.A1
  Bottom 0.381: S11.A2 S11.A1
26
  Top 0.381: U$1.26 40,63.37 40,116.71 41.27,117.98 41.27,120.02 40,121.29 32.01,121.29 S18.A2 S18.A1
27
  Top 0.381: S8.A2 40,17.75 40,58.29 U$1.27
  Bottom 0.381: S8.A1 S8.A2
28
  Top 0.381: U$1.28 37.46,55.75 37.46,48.64 30.61,41.78 30.61,25.78 22.19,17.37 S9.A2 S9.A1
29
  Bottom 0.381: S8.B1 S8.B2 41.42,18.78 40,20.19 40,55.75 U$1.29
30
  Top 0.381: S10.A1 S10.A2
  Bottom 0.381: S10.A2 12.15,10.03 29.84,10.03 31.11,11.3 31.11,20.19 37.46,26.54 37.46,57.71 38.05,58.29 40,58.29 U$1.30
31
  Top 0.381: U$1.31 40,60.83 14.86,60.83 12.99,58.97 S10.B2 S10.B1
32
  Top 0.381: U$1.32 43.05,66.42 43.05,72.77 42.29,73.53 42.29,82.17 43.05,82.93 44.32,82.93 45.14,83.74 52.6,83.74 60.11,91.25 S7.A2
  Bottom 0.381: S7.A2 S7.A1
33
  Bottom 0.381: U$1.33 42.54,65.91 42.54,27.18 S13.B2 S13.B1
A10
  Top 0.381: S12.A2 71.93,114.85 69.98,112.9 69.98,79.88 68.71,78.61 45.59,78.61 44.58,77.6 44.07,77.6 U$1.A10
  Bottom 0.381: S12.A1 S12.A2
A11
  Bottom 0.381: U$1.A11 45.08,76.07 53.97,76.07 59.31,81.41 59.31,99.19 64.56,104.44 S15.A2 S15.A1
A12
  Top 0.381: U$1.A12 38.73,118.3 S16.B2
  Bottom 0.381: S16.B1 S16.B2
A13
  Top 0.381: U$1.A13 41.27,116.32 S16.A2
  Bottom 0.381: S16.A1 S16.A2
A14
  Top 0.381: U$1.A14 53.97,44.32 53.97,25.02 S1.A2
  Bottom 0.381: S1.A2 S1.A1
AGND
  Top 0.381: U$1.AGND 57.53,96.14 57.53,101.73 64.56,108.76 S15.B2
  Bottom 0.381: S15.B2 S15.B1
AREF
  Bottom 0.381: U$1.AREF 42.29,81.41 42.29,105.54 50.93,114.17 61.09,114.17 65.45,118.54 S12.B2 S12.B1
DCV1
  Top 0.762: DCVA.B1 DCVA.B2
  Top 1.016: Q1.D 99.69,87.73 100.15,88.19 106.73,88.19 107.31,88.77 107.31,115.16 DCVA.B2
DCV2
  Top 0.762: DCVB.B1 DCVB.B2
  Bottom 0.762: DCVB.B2 89.76,115.6 92.46,112.9 98.42,112.9
  Bottom 1.016: 98.42,112.9 99.69,111.63 Q2.D
GND
  Top 0.381: U$1.GND1 38.73,25.7 S9.B2 S9.B1 | U$1.GND2 33.91,74.55 33.91,84.46 31.11,87.25 U$1.GND 27.05,91.57 27.05,115.19 24.27,117.97 S18.B2 S18.B1
  Top 0.508: U2.2 139.5,56.01 143.92,56.01 C14.- 144.37,55.6 C15.- 155.42,55.6 157.05,57.23 C7.- | C13.- C11.- 122.3,55.75 127.63,55.75 U1.2 | 3V3LDO.B1 3V3LDO.B2
  Top 1.016: 5V1.B2 5V1.B1 | 9V.B2 9V.B1 | 12V1.B2 12V1.B1
  Top 1.27: IC5.5 109.7,43.56 110.79,42.47 112.32,42.47 113.26,43.41 IC5.3 | IC4.5 138.07,43.79 139.37,42.49 140.77,42.49 141.63,43.36 IC4.3 | 5V2B.B2 5V2B.B1 | 5V2A.B1 5V2A.B2 142.34,19.66 146.68,24 146.68,30.4 C12.- | 12V2A.B2 12V2A.B1 | 12V2B.B1 12V2B.B2 113.13,19.66 117.47,24 117.47,31.85 C10.-
  Bottom 0.381: S9.B2 24.08,11.05 12.83,11.05 10.29,13.59 10.29,16.64 4.95,21.97 4.95,120.02 8.76,123.83 19.94,123.83 24.27,119.5 S18.B2
  Bottom 0.508: IC5.3 113.26,53.06 C13.- 111.56,58.11 3V3LDO.B2
  Bottom 0.762: 188.59,21.46 195.86,21.46 R12.A | C4.- 186.31,23.75 188.59,21.46 | 188.59,21.46 188.59,6.22 | 167.29,6.5 167,6.22 | 147.98,6.25 147.95,6.22 | 133.76,6.45 133.98,6.22 | 119.59,6.65 120.01,6.22
  Bottom 1.016: 222.88,19.13 222.88,18.92 | 5V1.B2 204.36,54.48 IC1.2 188.21,54.48 186.31,52.58 C2.- C3.- | 9V.B2 204.29,35.43 IC2.2 188.59,35.43 186.31,33.15 C4.- C5.- | IC3.2 169.55,41.73 | C7.- C6.- 167.44,52.91 169.54,50.8 169.54,41.76 IC3.2 | 113.26,43.03 113.26,43.05 | IC3.2 169.57,37.74 R11.A 164.21,35.18 161.92,32.89 161.92,25 12V1.B2 | R16.1 R14.1 | IC6.4 104.77,87.5 Q1.S | 5V1.B1 222.88,54.46 222.88,54.48 | 9V.B1 222.83,35.49 222.88,35.43 | 12V1.B1 167,11.66 167,6.22 | C10.- 113.21,36.65 113.26,36.7
  Bottom 1.27: C12.- 141.63,43.1 | C8.- 136.8,43.08 IC4.5 | 113.26,36.12 113.26,36.7 113.26,43 | 113.26,43 113.26,43.05 IC5.3 113.26,43.46 | C9.- 108.43,43.03 IC5.5 | 141.63,43.1 IC4.3 | 12V2B.B1 116.18,6.22 120.01,6.22 | 12V2A.B1 124.67,6.22 125.09,6.22 | 5V2A.B1 138.86,6.22 139.06,6.22 | 5V2B.B1 153.09,6.22 153.03,6.22 | D10.- 149.97,34.77 141.63,43.1 | D11.- 122.28,33.98 113.26,43
  Bottom 3.81: PWROUT4.P$2 PWROUT3.P$2 PWROUT2.P$2 PWROUT1.P$2 202.56,125.32 | 202.56,125.32 LIPO.P$2 222.88,125.32 222.88,54.48 222.88,35.43 222.88,18.92 222.88,6.22 188.59,6.22 167,6.22 153.03,6.22 147.95,6.22 139.06,6.22 133.98,6.22 125.09,6.22 120.01,6.22 | C1.- 207.64,107.82 203.83,111.63 203.83,124.05 202.56,125.32
  pour Bottom (isolate 0.381): 0,134.04 227.31,134.04 227.31,0 0,0
  pour Top (isolate 0.381): 0,134.04 227.31,134.04 227.31,0 0,0
LOWVIN
  Top 0.508: U2.1 140.45,59.16 | 140.45,59.16 143.03,59.16 C14.+ | U2.3 138.55,59.16 | 138.55,59.16 140.45,59.16 | B-REG.B2 B-REG.B1 | L4.1 136.3,59.16 138.55,59.16
  Bottom 0.508: B-REG.B2 120.78,58.29 133.98,58.29 135.46,59.77 L4.1
N$1
  Top 0.254: D2.A 200.02,98.93 215.26,98.93 C1.+
  Bottom 3.81: D1.A C1.+ 215.26,115.73 LIPO.P$1
N$2
  Bottom 3.81: D1.C 200.02,82.14 SWITCH.P$2
N$3
  Top 0.254: D3.K 200.02,46.86 R2.2
N$4
  Top 0.254: D2.K R1.2
N$5
  Top 0.254: D4.K 200.02,27.81 R3.2
N$6
  Bottom 0.254: D5.K 161.95,39.19 R4.2
N$7
  Bottom 0.254: D6.A 117.47,111.34 123.86,117.73
  Bottom 3.81: FUSE4.P$1 123.86,117.73 123.86,118.23 PWROUT4.P$1
N$8
  Bottom 0.254: 144.14,105.28 144.59,105.72 FUSE3.P$1 | D7.A 137.79,110.65 PWROUT3.P$1
  Bottom 3.81: FUSE3.P$1 145.45,118.23 PWROUT3.P$1
N$9
  Bottom 0.254: D8.A 159.38,110.65 PWROUT2.P$1
  Bottom 3.81: FUSE2.P$1 167.04,118.23 PWROUT2.P$1
N$10
  Bottom 0.254: D9.A 180.97,110.65 PWROUT1.P$1
  Bottom 3.81: FUSE1.P$1 188.63,118.23 PWROUT1.P$1
N$11
  Top 0.254: D9.K R7.2
N$12
  Top 0.254: D8.K R6.2
N$13
  Top 0.254: D7.K R5.2
N$14
  Top 0.254: D6.K R8.2
N$15
  Top 0.254: D13.K 125.09,29.08 R9.2
N$16
  Bottom 1.27: D10.+ 143.86,49.27 L1.1 IC4.2
N$17
  Bottom 1.27: IC5.2 L2.1 115.21,48.97 117.81,48.97 118.3,48.48 D11.+
N$18
  Top 0.254: D14.K 96.75,30.33 R10.2
N$19
  Bottom 1.016: IC6.1 95.88,92.58 95.88,86.23 Q1.G
N$20
  Top 1.016: Q2.G 102.23,107.32 100.46,105.54 100.46,102.24 IC6.7
N$21
  Bottom 1.016: R13.1 R14.2 99.69,91.31 IC6.2
N$22
  Top 0.762: R15.1 IC6.6
  Bottom 1.016: R16.2 R15.1
N$25
  Top 0.508: U1.5 128.58,54.15 131.44,54.15 L3.1
N$26  (via drill 0.7)
  Top 0.508: 3V3LDO.A1 3V3LDO.A2 | v124.33,52.6 126.36,52.6 | 126.36,52.6 126.68,52.6 U1.4 | L3.2 127.03,51.94 126.36,52.6
  Bottom 0.508: 3V3LDO.A2 108.59,63.11 C13.+ 116.71,56.77 117.73,55.75 117.73,54.1 119.25,52.58 124.31,52.58 v124.33,52.6 124.33,52.65
N$28
  Top 0.508: U2.5 140.45,53.33 139.19,52.07 135.76,52.07 L4.2
PGM
  Top 0.381: U$1.PGM 50.56,45.19 S13.A2
  Bottom 0.381: S13.A2 S13.A1
POTIN1
  Top 0.762: POT1.A1 POT1.A2
  Bottom 0.762: R11.E 168.92,30.1 POT1.A2
POTIN2
  Top 0.762: POT2.A1 POT2.A2
  Bottom 0.762: R12.E 193.19,16.87 193.67,16.38 201.32,16.38 POT2.A2
POTOUT1
  Top 0.762: POT1.B1 POT1.B2
  Bottom 0.762: R11.S 172.08,29.08 178.43,22.73 181.29,22.73 POT1.B2
POTOUT2
  Top 0.762: POT2.B1 POT2.B2
  Bottom 0.762: R12.S 203.91,13.97 POT2.B2
TRG1
  Top 1.016: DCVCTRL.A2 DCVCTRL.A1
  Bottom 1.016: DCVCTRL.A2 93.34,21.87 93.34,93.35 96.39,96.39 99.69,96.39 IC6.3
TRG2
  Top 1.016: DCVCTRL.B1 DCVCTRL.B2 93.34,22.51 93.34,93.85 95.88,96.39 99.69,96.39 IC6.5
VBAT
  Top 0.381: U$1.VBAT 33.36,54.48 S17.B2
  Bottom 0.381: S17.B2 S17.B1
VCC  (via drill 1.3)
  Top 1.27: C9.+ 105.18,46.38 111.38,46.38 | C8.+ 132.33,46.48 144.4,46.48 145.16,45.72 145.16,44.37 IC4.1 | IC5.1 116.81,46.38 111.38,46.38 | 111.38,46.38 111.38,57.79 113.28,59.69 119.63,59.69 121.41,61.47 v124.59,61.47
  Bottom 1.016: C6.+ 160.68,50.62 | 160.68,50.62 158.8,50.62 156.97,52.45 156.97,65.48 156.72,65.73 | 160.68,50.62 165.4,50.62 166.88,49.15 166.88,41.88 IC3.1 | C2.+ 188.34,49.78 190.5,51.94 IC1.1 205.61,51.94 206.88,53.21 206.88,57.15 205.49,58.55 200.41,58.55 197.36,61.6 197.36,66.2 | C4.+ 188.34,32.89 IC2.1 205.36,32.89 208.91,36.45 208.91,58.67 206.76,60.83 201.55,60.83 200.02,62.36 200.02,65.95 199.77,66.2
  Bottom 1.27: 154.97,65.73 154.3,65.73 | 131.19,65.73 130.94,65.48 130.94,64.39 128.14,61.6 124.71,61.6 v124.59,61.47 | 155.19,65.73 154.94,65.48 154.94,46.74 152.6,44.4 145.24,44.4 IC4.1
  Bottom 3.81: SWITCH.P$1 199.77,66.2 197.36,66.2 189.12,66.2 FUSE1.P$2 FUSE2.P$2 156.72,65.73 155.19,65.73 154.3,65.73 FUSE3.P$2 131.19,65.73 FUSE4.P$2
VUSB
  Top 0.381: U$1.VUSB 43.81,89.28 50.93,96.39 50.93,116.75 S14.B2
  Bottom 0.381: S14.B1 S14.B2

### Text on the board
Bottom: Designed at Robocon Labs
tPlace: ROBOCON'16 | SRM TEAM ROBOCON | XshuPaul
tNames: 0V | 1 | 0 | GND | 26 | A12 | A13 | VUSB | 5V2 | AREF | A10 | 12V | 0V | 12V | A15 | 2 | 3 | P/TX-CAN | AGND | A11 | 4 | P/RX-CAN | 24 | 5 | P | TEENSY | P | 32 | 6 | P/TX3 | A9/P | 23 | 7 | 3V3 | RX3 | 22 | A8/P | 0.9VI/P | 8 | A7/P | 21 | 9 | SWITCH | P/TX2 | 3V3 | 20 | A6/P | 0V | 10 | P/RX2 | SCL0 | A5 | 0V | 19 | 11 | SDA0 | A4 | 5V | 18 | 12 | VBAT | A3 | 17 | A2 | 0V | 16 | 25 | 9V | P | 3V3 | A1 | 15 | A20/31 | A0 | 14 | A17 | A16 | A18/SCL1 | TRG1 | TRG2 | 12V | 12V | 0V | 5V | 0V | 5V | 0V | 12V | 0V | I/P | O/P | I/P | O/P | A14/DAC | A19/30/SDA1 | 13 | 30 | 31 | 28 | GND | 27 | 29 | PGM | 33 | A14